# EAGLE schematic Comunication Board (EAGLE 9.5.0)

## Sheet 1 of 2: Serial COM
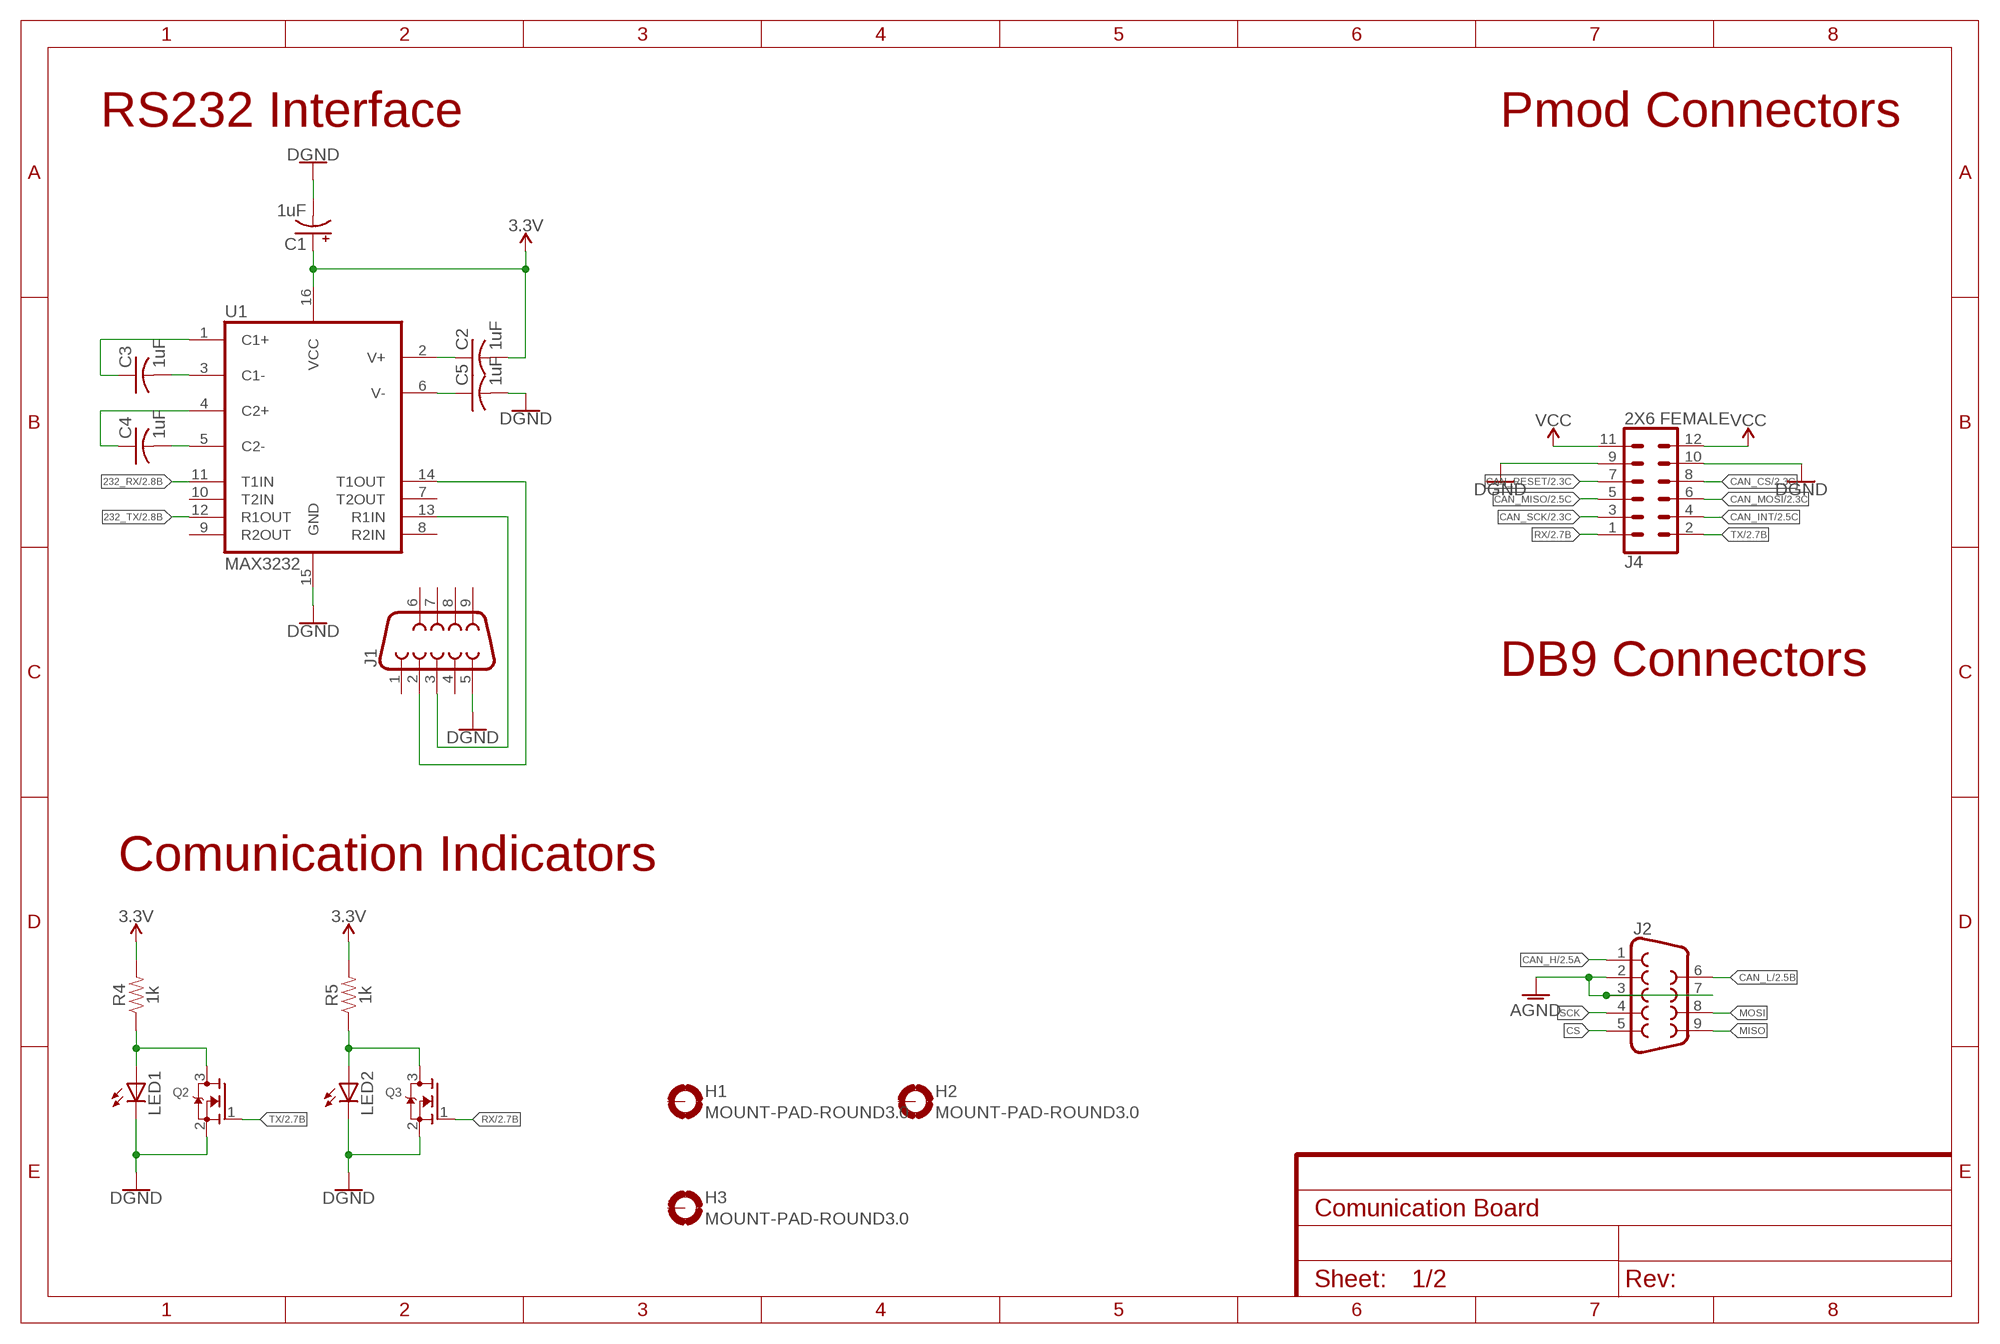
[diagram p0: schematic, sheet 1]

### Parts
C1  1uF  CPOL-USB  [PANASONIC_B]
C2  1uF  C-USC0805  [C0805]
C3  1uF  C-USC0805  [C0805]
C4  1uF  C-USC0805  [C0805]
C5  1uF  C-USC0805  [C0805]
H1  MOUNT-PAD-ROUND3.0  [3,0-PAD]
H2  MOUNT-PAD-ROUND3.0  [3,0-PAD]
H3  MOUNT-PAD-ROUND3.0  [3,0-PAD]
J1  DB9FEMALE  [DB9]
J2  DB9FEMALE  [DB9]
J4  2X6 FEMALE  CONN_06X2PTH_FEMALE  [2X6]
LED1  LEDCHIP-LED0805  [CHIP-LED0805]
LED2  LEDCHIP-LED0805  [CHIP-LED0805]
Q2  MOSFET-NWAVE  [SOT23-W]
Q3  MOSFET-NWAVE  [SOT23-W]
R4  1k  RESISTOR0805  [0805]
R5  1k  RESISTOR0805  [0805]
U1  MAX3232  MAX2323SOIC16  [SO16]

### Nets
3.3V: C1.+ C2.2 R4.2 R5.2 U1.16(VCC) ; also sheet 2
232_RX: U1.11(T1IN) ; also sheet 2
232_TX: U1.12(R1OUT) ; also sheet 2
AGND: J2.2 J2.3 J2.7
CAN_CS: J4.8 ; also sheet 2
CAN_H: J2.1 ; also sheet 2
CAN_INT: J4.4 ; also sheet 2
CAN_L: J2.6 ; also sheet 2
CAN_MISO: J4.5 ; also sheet 2
CAN_MOSI: J4.6 ; also sheet 2
CAN_RESET: J4.7 ; also sheet 2
CAN_SCK: J4.3 ; also sheet 2
CS: J2.5
GND: C1.- C5.2 J1.5 J4.9 J4.10 LED1.C LED2.C Q2.2(S) Q3.2(S) U1.15(GND) ; supply symbol labelled DGND ; also sheet 2
MISO: J2.9
MOSI: J2.8
N$1: C3.2 U1.3(C1-)
N$2: C2.1 U1.2(V+)
N$3: C3.1 U1.1(C1+)
N$4: C4.1 U1.4(C2+)
N$5: C4.2 U1.5(C2-)
N$6: C5.1 U1.6(V-)
N$8: LED2.A Q3.3(D) R5.1
N$9: J1.2 U1.14(T1OUT)
N$10: J1.3 U1.13(R1IN)
N$12: LED1.A Q2.3(D) R4.1
RX: J4.1 Q3.1(G) ; also sheet 2
SCK: J2.4
TX: J4.2 Q2.1(G) ; also sheet 2
VCC: J4.11 J4.12
Unconnected: H1.B3,0(MOUNT) H2.B3,0(MOUNT) H3.B3,0(MOUNT) J1.1 J1.4 J1.6 J1.7 J1.8 J1.9 U1.7(T2OUT) U1.8(R2IN) U1.9(R2OUT) U1.10(T2IN)

### Notes on the sheet
- RS232 Interface | Pmod Connectors
- DB9 Connectors
- Comunication Indicators

## Sheet 2 of 2: Field Bus COM
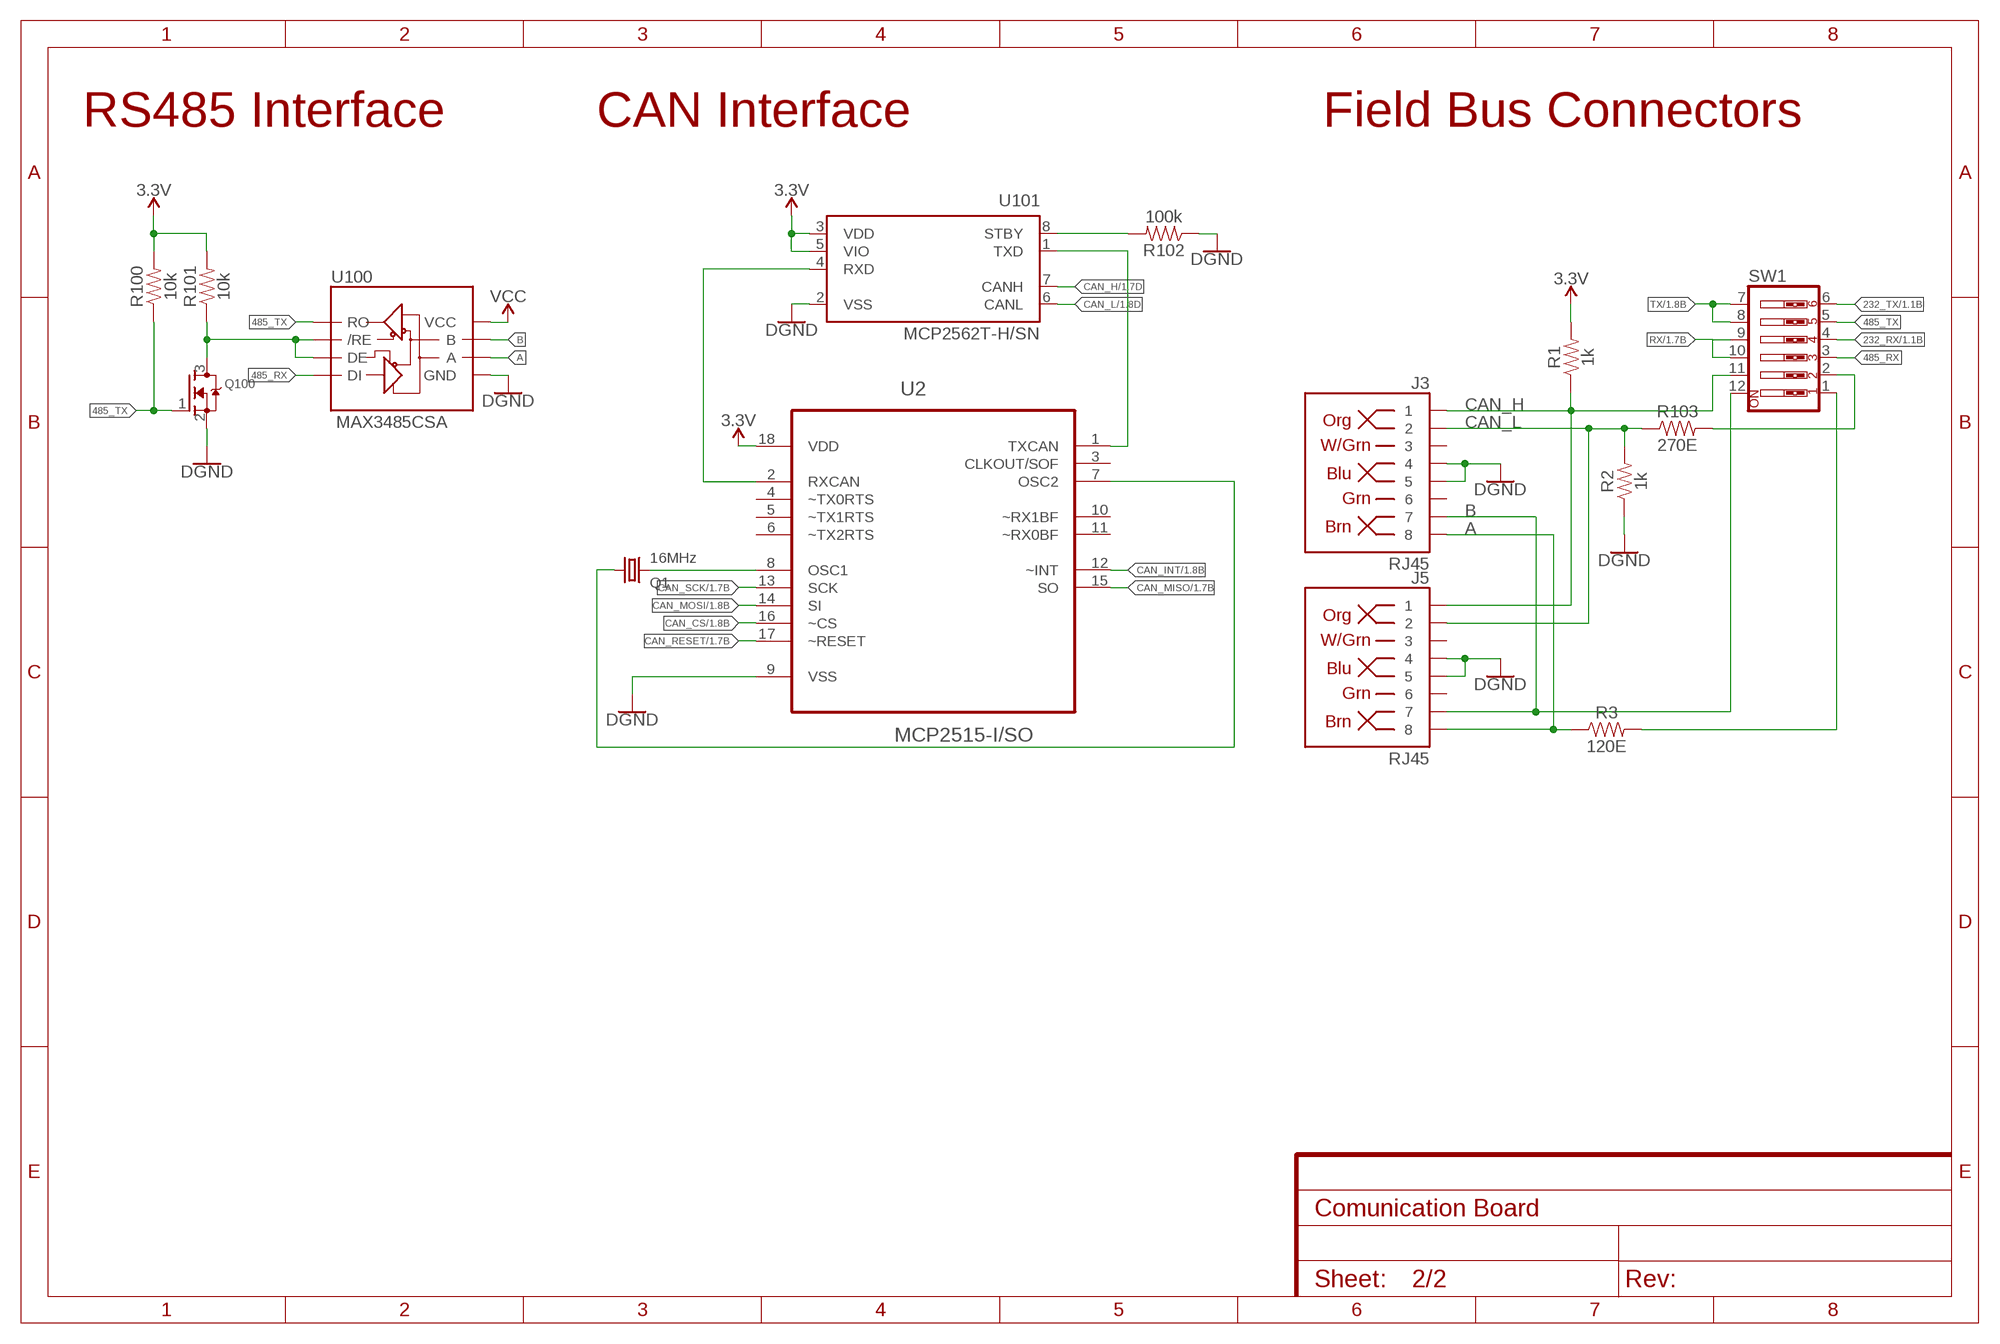
[diagram p1: schematic, sheet 2]

### Parts
J3  RJ45  RJ45-8  [RJ45-8]
J5  RJ45  RJ45-8  [RJ45-8]
Q1  16MHz  CRYSTALHC49UP  [HC49UP]
Q100  MOSFET-NWAVE  [SOT23-W]
R1  1k  RESISTOR0805  [0805]
R2  1k  RESISTOR0805  [0805]
R3  120E  RESISTOR0805  [0805]
R100  10k  RESISTOR0805  [0805]
R101  10k  RESISTOR0805  [0805]
R102  100k  RESISTOR0805  [0805]
R103  270E  RESISTOR0805  [0805]
SW1  SW_DIP-6  [EDG-06]
U2  MCP2515-I/SO  [SOIC127P1034X264-18N]
U100  MAX3485CSA  RS485SOIC  [SO08]
U101  MCP2562T-H/SN  [SOIC127P600X175-8N]

### Nets
3.3V: R1.2 R100.2 R101.2 U2.18(VDD) U101.3(VDD) U101.5(VIO) ; also sheet 1
5V: U100.8(VCC) ; supply symbol labelled VCC
232_RX: SW1.4 ; also sheet 1
232_TX: SW1.6 ; also sheet 1
485_RX: SW1.3 U100.4(DI)
485_TX: Q100.1(G) R100.1 SW1.5 U100.1(RO)
A: J3.8 J5.8 R3.1 U100.6(A)
B: J3.7 J5.7 SW1.12 U100.7(B)
CAN_CS: U2.16(~CS) ; also sheet 1
CAN_H: J3.1 J5.1 R1.1 SW1.11 U101.7(CANH) ; also sheet 1
CAN_INT: U2.12(~INT) ; also sheet 1
CAN_L: J3.2 J5.2 R2.2 R103.1 U101.6(CANL) ; also sheet 1
CAN_MISO: U2.15(SO) ; also sheet 1
CAN_MOSI: U2.14(SI) ; also sheet 1
CAN_RESET: U2.17(~RESET) ; also sheet 1
CAN_SCK: U2.13(SCK) ; also sheet 1
GND: J3.4 J3.5 J5.4 J5.5 Q100.2(S) R2.1 R102.1 U2.9(VSS) U100.5(GND) U101.2(VSS) ; supply symbol labelled DGND ; also sheet 1
N$7: R103.2 SW1.2
N$15: U2.1(TXCAN) U101.1(TXD)
N$16: U2.2(RXCAN) U101.4(RXD)
N$17: Q1.2 U2.8(OSC1)
N$18: R3.2 SW1.1
N$19: Q1.1 U2.7(OSC2)
N$28: Q100.3(D) R101.1 U100.2(/RE) U100.3(DE)
N$41: R102.2 U101.8(STBY)
RX: SW1.9 SW1.10 ; also sheet 1
TX: SW1.7 SW1.8 ; also sheet 1
Unconnected: J3.3 J3.6 J5.3 J5.6 U2.3(CLKOUT/SOF) U2.4(~TX0RTS) U2.5(~TX1RTS) U2.6(~TX2RTS) U2.10(~RX1BF) U2.11(~RX0BF)

### Notes on the sheet
- RS485 Interface | CAN Interface | Field Bus Connectors

## Library data of the parts
C1 = adafruit:CPOL-US: POLARIZED CAPACITOR, American symbol
C2-C5 = adafruit:C-US: CAPACITOR, American symbol
H1-H3 = holes:MOUNT-PAD-ROUND: MOUNTING PAD, round
J1 J2 = SparkFun-Connectors:DB9: DB9 Connector Standard DB9 (D-Sub 9) serial connector. Can be used for CAN bus as well as RS485 and RS232. Footprint production proven. Here is the female version connector we sell at SparkFun: 9 Pin Female Serial Connector - PCB Mount <https://www.sparkfun.com/products/429> (PRT-00429) This connector has been used on the following SparkFun products: SparkFun RS232 Shifter - SMD <https://www.sparkfun.com/products/449> (PRT-00449) SparkFun RS232 Shifter SMD (No DB9) <https://www.sparkfun.com/products/8780> (PRT-08780); PROD_ID: CONN-08194
J3 J5 = SparkFun-Connectors:RJ45-8: RJ45 Jack - 8 pin Simple RJ45, 8-pin connection. Commonly used for Cat5, Cat5e, and Cat6 Ethernet cables. Here is the connector we sell at SparkFun: RJ45 8-Pin Connector <https://www.sparkfun.com/products/643> (PRT-00643) Datasheet <https://cdn.sparkfun.com/datasheets/Prototyping/04908.pdf> It is used on this SparkFun product: SparkFun RJ45 Breakout <https://www.sparkfun.com/products/716> (BOB-00716) Note, you may also be interested in the "MAGJACK" version of this. It is basically a RJ45 connector, but also has some status LEDs built into the connector housing. You can check that out in this library at the device named "MAGJACK.dev" and see these products online: RJ45 Ethernet MagJack-Compatible <https://www.sparkfun.com/products/8534> (PRT-08534) SparkFun RJ45 MagJack Breakout <https://www.sparkfun.com/products/13021> (BOB-13021); PROD_ID: CONN-08506; SF_ID: PRT-00643
J4 = SparkFun-Connectors:CONN_06X2: Multi connection point. Often used as Generic Header-pin footprint for 0.1 inch spaced/style header connections On any of the 0.1 inch spaced packages, you can populate with these: Break Away Headers - Straight <https://www.sparkfun.com/products/116> (PRT-00116) Break Away Male Headers - Right Angle <https://www.sparkfun.com/products/553> (PRT-00553) Female Headers <https://www.sparkfun.com/products/115> (PRT-00115) Break Away Headers - Machine Pin <https://www.sparkfun.com/products/117> (PRT-00117) Break Away Female Headers - Swiss Machine Pin <https://www.sparkfun.com/products/743> (PRT-00743); PROD_ID: CONN-12423
LED1 LED2 = adafruit:LED: LED OSRAM: - CHIPLED LG R971, LG N971, LY N971, LG Q971, LY Q971, LO R971, LY R971 LH N974, LH R974 LS Q976, LO Q976, LY Q976 LO Q996 - Hyper CHIPLED LW Q18S LB Q993, LB Q99A, LB R99A - SideLED LS A670, LO A670, LY A670, LG A670, LP A670 LB A673, LV A673, LT A673, LW A673 LH A674 LY A675 LS A676, LA A676, LO A676, LY A676, LW A676 LS A679, LY A679, LG A679 - Hyper Micro SIDELED® LS Y876, LA Y876, LO Y876, LY Y876 LT Y87S - SmartLED LW L88C, LW L88S LB L89C, LB L89S, LG L890 LS L89K, LO L89K, LY L89K LS L896, LA L896, LO L896, LY L896 - TOPLED LS T670, LO T670, LY T670, LG T670, LP T670 LSG T670, LSP T670, LSY T670, LOP T670, LYG T670 LG T671, LOG T671, LSG T671 LB T673, LV T673, LT T673, LW T673 LH T674 LS T676, LA T676, LO T676, LY T676, LB T676, LH T676, LSB T676, LW T676 LB T67C, LV T67C, LT T67C, LS T67K, LO T67K, LY T67K, LW E67C LS E67B, LA E67B, LO E67B, LY E67B, LB E67C, LV E67C, LT E67C LW T67C LS T679, LY T679, LG T679 LS T770, LO T770, LY T770, LG T770, LP T770 LB T773, LV T773, LT T773, LW T773 LH T774 LS E675, LA E675, LY E675, LS T675 LS T776, LA T776, LO T776, LY T776, LB T776 LHGB T686 LT T68C, LB T68C - Hyper Mini TOPLED® LB M676 - Mini TOPLED Santana® LG M470 LS M47K, LO M47K, LY M47K Source: http://www.osram.convergy.de/
Q1 = adafruit:CRYSTAL: CRYSTAL; OC_FARNELL: unknown; OC_NEWARK: unknown
Q2 Q3 Q100 = adafruit:MOSFET-N: N-Channel Mosfet 2N7002E - 60V 260mA SOT23 [Digikey: 2N7002ET1GOSTR-ND] - REEL BSH103 - 30V 850mA SOT23 [Digikey: 568-5013-1-ND]
R1-R5 R100-R103 = SparkFun-Resistors:RESISTOR: Generic Resistor Package
SW1 = special:SW_DIP-6: DIP SWITCH
U1 = SparkFun-IC-Comms:MAX2323: RS232 Transceiver This part covers 232 drivers that are compatible with the MAX3232. Sipex SP3232EB Datasheet <http://cdn.sparkfun.com/datasheets/Components/General%20IC/SP3232EBCA-L.pdf> SparkFun Products SOIC component <https://www.sparkfun.com/products/589> (COM-00589 / IC-08171) Retired DIP component (COM-00316 / IC-08446) SparkFun Transceiver Breakout - MAX3232 <https://www.sparkfun.com/products/11189> (BOB-11189) SparkFun XBee Explorer Serial <https://www.sparkfun.com/products/13225> (WRL-13225); PROD_ID: IC-08171
U2 = MCP2515-I_SO:MCP2515-I/SO: CAN Controller; AVAILABILITY: Unavailable; DESCRIPTION: MCP2515 Series 5.5 V 1 Mb/s Stand Alone SPI Interface CAN Controller- SOIC-18; MF: Microchip; MP: MCP2515-I/SO; PACKAGE: SOIC-18 Microchip; PRICE: None
U100 = SparkFun-IC-Comms:RS485: RS-485 Transceiver SP3485 Series 8 Pin NSOIC 3.3 V Low Power Half Duplex RS-485 Transceiver MAX3485 compatible Datasheet <http://www.sparkfun.com/datasheets/Components/General/sp3485CN-LTR.pdf> SparkFun Products SparkFun Transceiver Breakout - RS-485 <https://www.sparkfun.com/products/10124> (BOB-10124) SparkFun USB to RS-485 Converter <https://www.sparkfun.com/products/9822> (BOB-09822); PROD_ID: IC-09388
U101 = MCP2562T-H_SN:MCP2562T-H/SN: MCP2562 Series 5 V Surface Mount High-Speed CAN Transceiver - SOIC-8; AVAILABILITY: Unavailable; DESCRIPTION: CAN 1Mbps Standby 5.5V 8-Pin SOIC T/R; MF: Microchip; MP: MCP2562T-H/SN; PACKAGE: SO-8 Microchip; PRICE: None